# Altium project I2C.PrjPcb
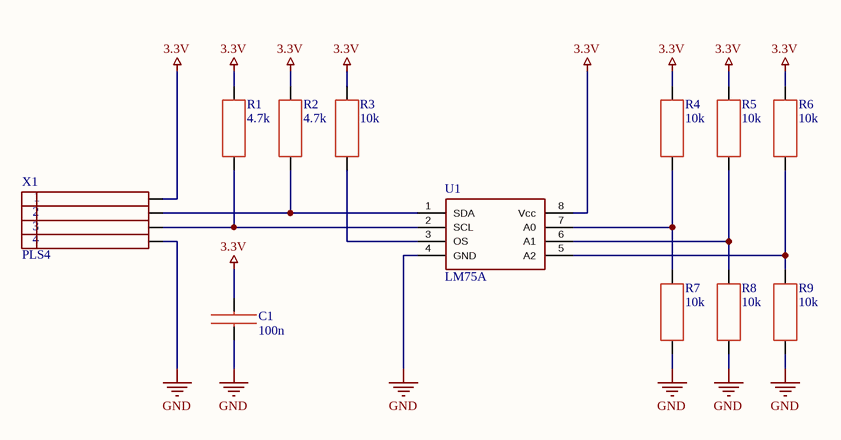
[diagram p0: I2C_Sheet.SchDoc]
1 sheet, 12 parts. Net scope: global (net labels, ports and power ports of the same name join across sheets).
Board file: I2C_PCB.PcbDoc

## Sheet I2C_Sheet.SchDoc: Наименование
size 420 x 297 mm; ApprovedBy: Утвердил; CheckedBy: Проверил; Author: Разработал; CompanyName: Организация; DrawnBy: Н.Контр; Engineer: Т.Контр; SheetNumber: 1; SheetTotal: 1; PageSetup: Record=PageOptions|CenterHorizontal=True|CenterVertical=True|PrintScale=0.94|XCorrection=1.00|YCorrection=1.00|PrintKind=1|BorderSize=5000000|LeftOffset=0|BottomOffset=0|Orientation=1|PaperLength=1000|PaperWidth=1000|Scale=100|PaperSource=7|PrintQuality=-4|MediaType=1|DitherType=10|PaperKind=A4|PrintScaleMode=1; DecimalNumber: Децимальный номер; HeadOfSector: Нач. сектора; MainDevice: Перв.примен.; Name: Наименование; DocumentName: Sheet1.SCHDOC

### Parts
C1  100n  [CC0805_3D]
R1  4.7k  [RC0805_3D]
R2  4.7k  [RC0805_3D]
R3  10k  [RC0805_3D]
R4  10k  [RC0805_3D]
R5  10k  [RC0805_3D]
R6  10k  [RC0805_3D]
R7  10k  [RC0805_3D]
R8  10k  [RC0805_3D]
R9  10k  [RC0805_3D]
U1  LM75A  [SOIC-8]
X1  PLS4  [PLS4]

### Nets
3.3V: C1.2 R1.2 R2.2 R3.2 R4.2 R5.2 R6.2 U1.8(Vcc) X1.1
GND: C1.1 R7.1 R8.1 R9.1 U1.4(GND) X1.4
NetR1_1: R1.1 U1.2(SCL) X1.3
NetR2_1: R2.1 U1.1(SDA) X1.2
NetR3_1: R3.1 U1.3(OS)
NetR4_1: R4.1 R7.2 U1.7(A0)
NetR5_1: R5.1 R8.2 U1.6(A1)
NetR6_1: R6.1 R9.2 U1.5(A2)

### Notes on the sheet
- Перв.примен.
- Справ.№
- Подп. и дата
- Инв.№ дубл.
- Взам.инв.№
- Подп.и дата
- Разраб.
- Изм.
- Лист
- № докум.
- Подп.
- Дата
- Лит.
- Масштаб
- Масса
- Т.контр.
- Пров.
- СХЕМА   ЭЛЕКТРИЧЕСКАЯ
- ПРИНЦИПИАЛЬНАЯ
- Листов
- Инв.№ подл.
- Утв.
- Н.контр.
- Нач.сект.
- Формат  A3

### Library data of the parts
C1 = CC0805 X uF: Value: 100n
R1-R9 = RC0805 X Ohm
  R1 R2: Value: 4.7k
  R3-R9: Value: 10k